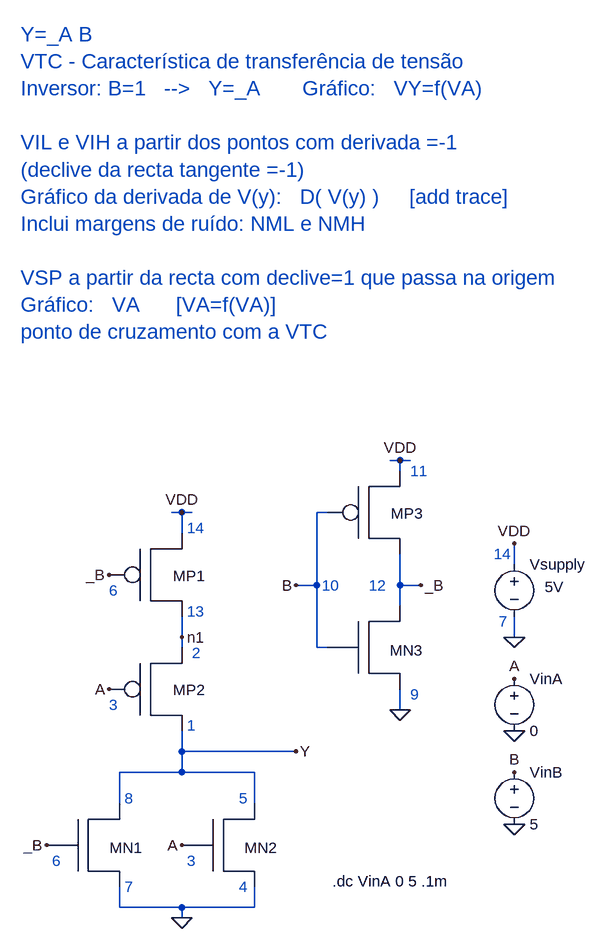
[diagram p0: schematic static-gate-VTC-VILHSP.asc]
static-gate-VTC-VILHSP.asc, the LTspice schematic file:
Version 4
SHEET 1 2472 680
WIRE 704 -128 688 -128
WIRE 720 -128 704 -128
WIRE 704 -112 704 -128
WIRE 368 -48 352 -48
WIRE 384 -48 368 -48
WIRE 592 -48 576 -48
WIRE 368 -16 368 -48
WIRE 880 32 880 0
WIRE 576 64 576 -48
WIRE 576 64 544 64
WIRE 704 64 704 16
WIRE 736 64 704 64
WIRE 704 96 704 64
WIRE 368 144 368 112
WIRE 880 144 880 112
WIRE 368 160 368 144
WIRE 576 160 576 64
WIRE 592 160 576 160
WIRE 704 256 704 224
WIRE 368 320 368 288
WIRE 544 320 368 320
WIRE 368 352 368 320
WIRE 368 352 272 352
WIRE 480 352 368 352
WIRE 272 400 272 352
WIRE 480 400 480 352
WIRE 272 560 272 528
WIRE 368 560 272 560
WIRE 480 560 480 528
WIRE 480 560 368 560
WIRE 368 576 368 560
FLAG 880 144 0
FLAG 880 288 0
FLAG 880 432 0
FLAG 880 0 VDD
FLAG 880 208 A
FLAG 880 352 B
FLAG 704 -128 VDD
FLAG 544 64 B
FLAG 736 64 _B
FLAG 368 -48 VDD
FLAG 256 48 _B
FLAG 160 464 _B
FLAG 256 224 A
FLAG 368 464 A
FLAG 544 320 Y
FLAG 368 144 n1
FLAG 704 256 0
FLAG 368 576 0
SYMBOL voltage 880 16 R0
WINDOW 3 47 51 Left 2
SYMATTR Value 5V
SYMATTR InstName Vsupply
SYMBOL voltage 880 192 R0
WINDOW 123 0 0 Left 2
WINDOW 39 0 0 Left 2
SYMATTR InstName VinA
SYMATTR Value 0
SYMBOL voltage 880 336 R0
WINDOW 123 0 0 Left 2
WINDOW 39 0 0 Left 2
SYMATTR InstName VinB
SYMATTR Value 5
SYMBOL PMOSX 336 32 R0
SYMATTR InstName MP1
SYMBOL PMOSX 336 208 R0
SYMATTR InstName MP2
SYMBOL PMOSX 672 -64 R0
SYMATTR InstName MP3
SYMBOL NMOSX 240 448 R0
SYMATTR InstName MN1
SYMBOL NMOSX 448 448 R0
SYMATTR InstName MN2
SYMBOL NMOSX 672 144 R0
SYMATTR InstName MN3
TEXT 600 520 Left 2 !.dc VinA 0 5 .1m
TEXT 848 16 Left 2 ;14
TEXT 856 120 Left 2 ;7
TEXT 120 -784 Left 3 ;Y=_A B\nVTC - Característica de transferência de tensão\nInversor: B=1   -->   Y=_A       Gráfico:   VY=f(VA)\n \nVIL e VIH a partir dos pontos com derivada =-1\n(declive da recta tangente =-1)\nGráfico da derivada de V(y):   D( V(y) )     [add trace]\nInclui margens de ruído: NML e NMH\n \nVSP a partir da recta com declive=1 que passa na origem\nGráfico:   VA      [VA=f(VA)]\nponto de cruzamento com a VTC
TEXT 256 72 Left 2 ;6
TEXT 168 488 Left 2 ;6
TEXT 256 248 Left 2 ;3
TEXT 376 488 Left 2 ;3
TEXT 376 -24 Left 2 ;14
TEXT 376 104 Left 2 ;13
TEXT 280 392 Left 2 ;8
TEXT 280 528 Left 2 ;7
TEXT 456 392 Left 2 ;5
TEXT 456 528 Left 2 ;4
TEXT 384 168 Left 2 ;2
TEXT 376 280 Left 2 ;1
TEXT 584 64 Left 2 ;10
TEXT 720 -112 Left 2 ;11
TEXT 656 64 Left 2 ;12
TEXT 720 232 Left 2 ;9

The netlist it stands for:
* static-gate-VTC-VILHSP.asc
Vsupply VDD 0 5V
VinA A 0 0
VinB B 0 5
XMP1 n1 _B VDD PMOSX  ; pins D G S
XMP2 Y A n1 PMOSX  ; pins D G S
XMP3 _B B VDD PMOSX  ; pins D G S
XMN1 Y _B 0 NMOSX  ; pins D G S
XMN2 Y A 0 NMOSX  ; pins D G S
XMN3 _B B 0 NMOSX  ; pins D G S
.dc VinA 0 5 .1m
* 14
* 7
* Y=_A B
* VTC - Característica de transferência de tensão
* Inversor: B=1   -->   Y=_A       Gráfico:   VY=f(VA)
* VIL e VIH a partir dos pontos com derivada =-1
* (declive da recta tangente =-1)
* Gráfico da derivada de V(y):   D( V(y) )     [add trace]
* Inclui margens de ruído: NML e NMH
* VSP a partir da recta com declive=1 que passa na origem
* Gráfico:   VA      [VA=f(VA)]
* ponto de cruzamento com a VTC
* 6
* 6
* 3
* 3
* 14
* 13
* 8
* 7
* 5
* 4
* 2
* 1
* 10
* 11
* 12
* 9
.lib MOS4007.txt
.backanno
.end